# EAGLE design master_fin_itr7 (EAGLE 9.6.2)

## Sheet 1 of 2
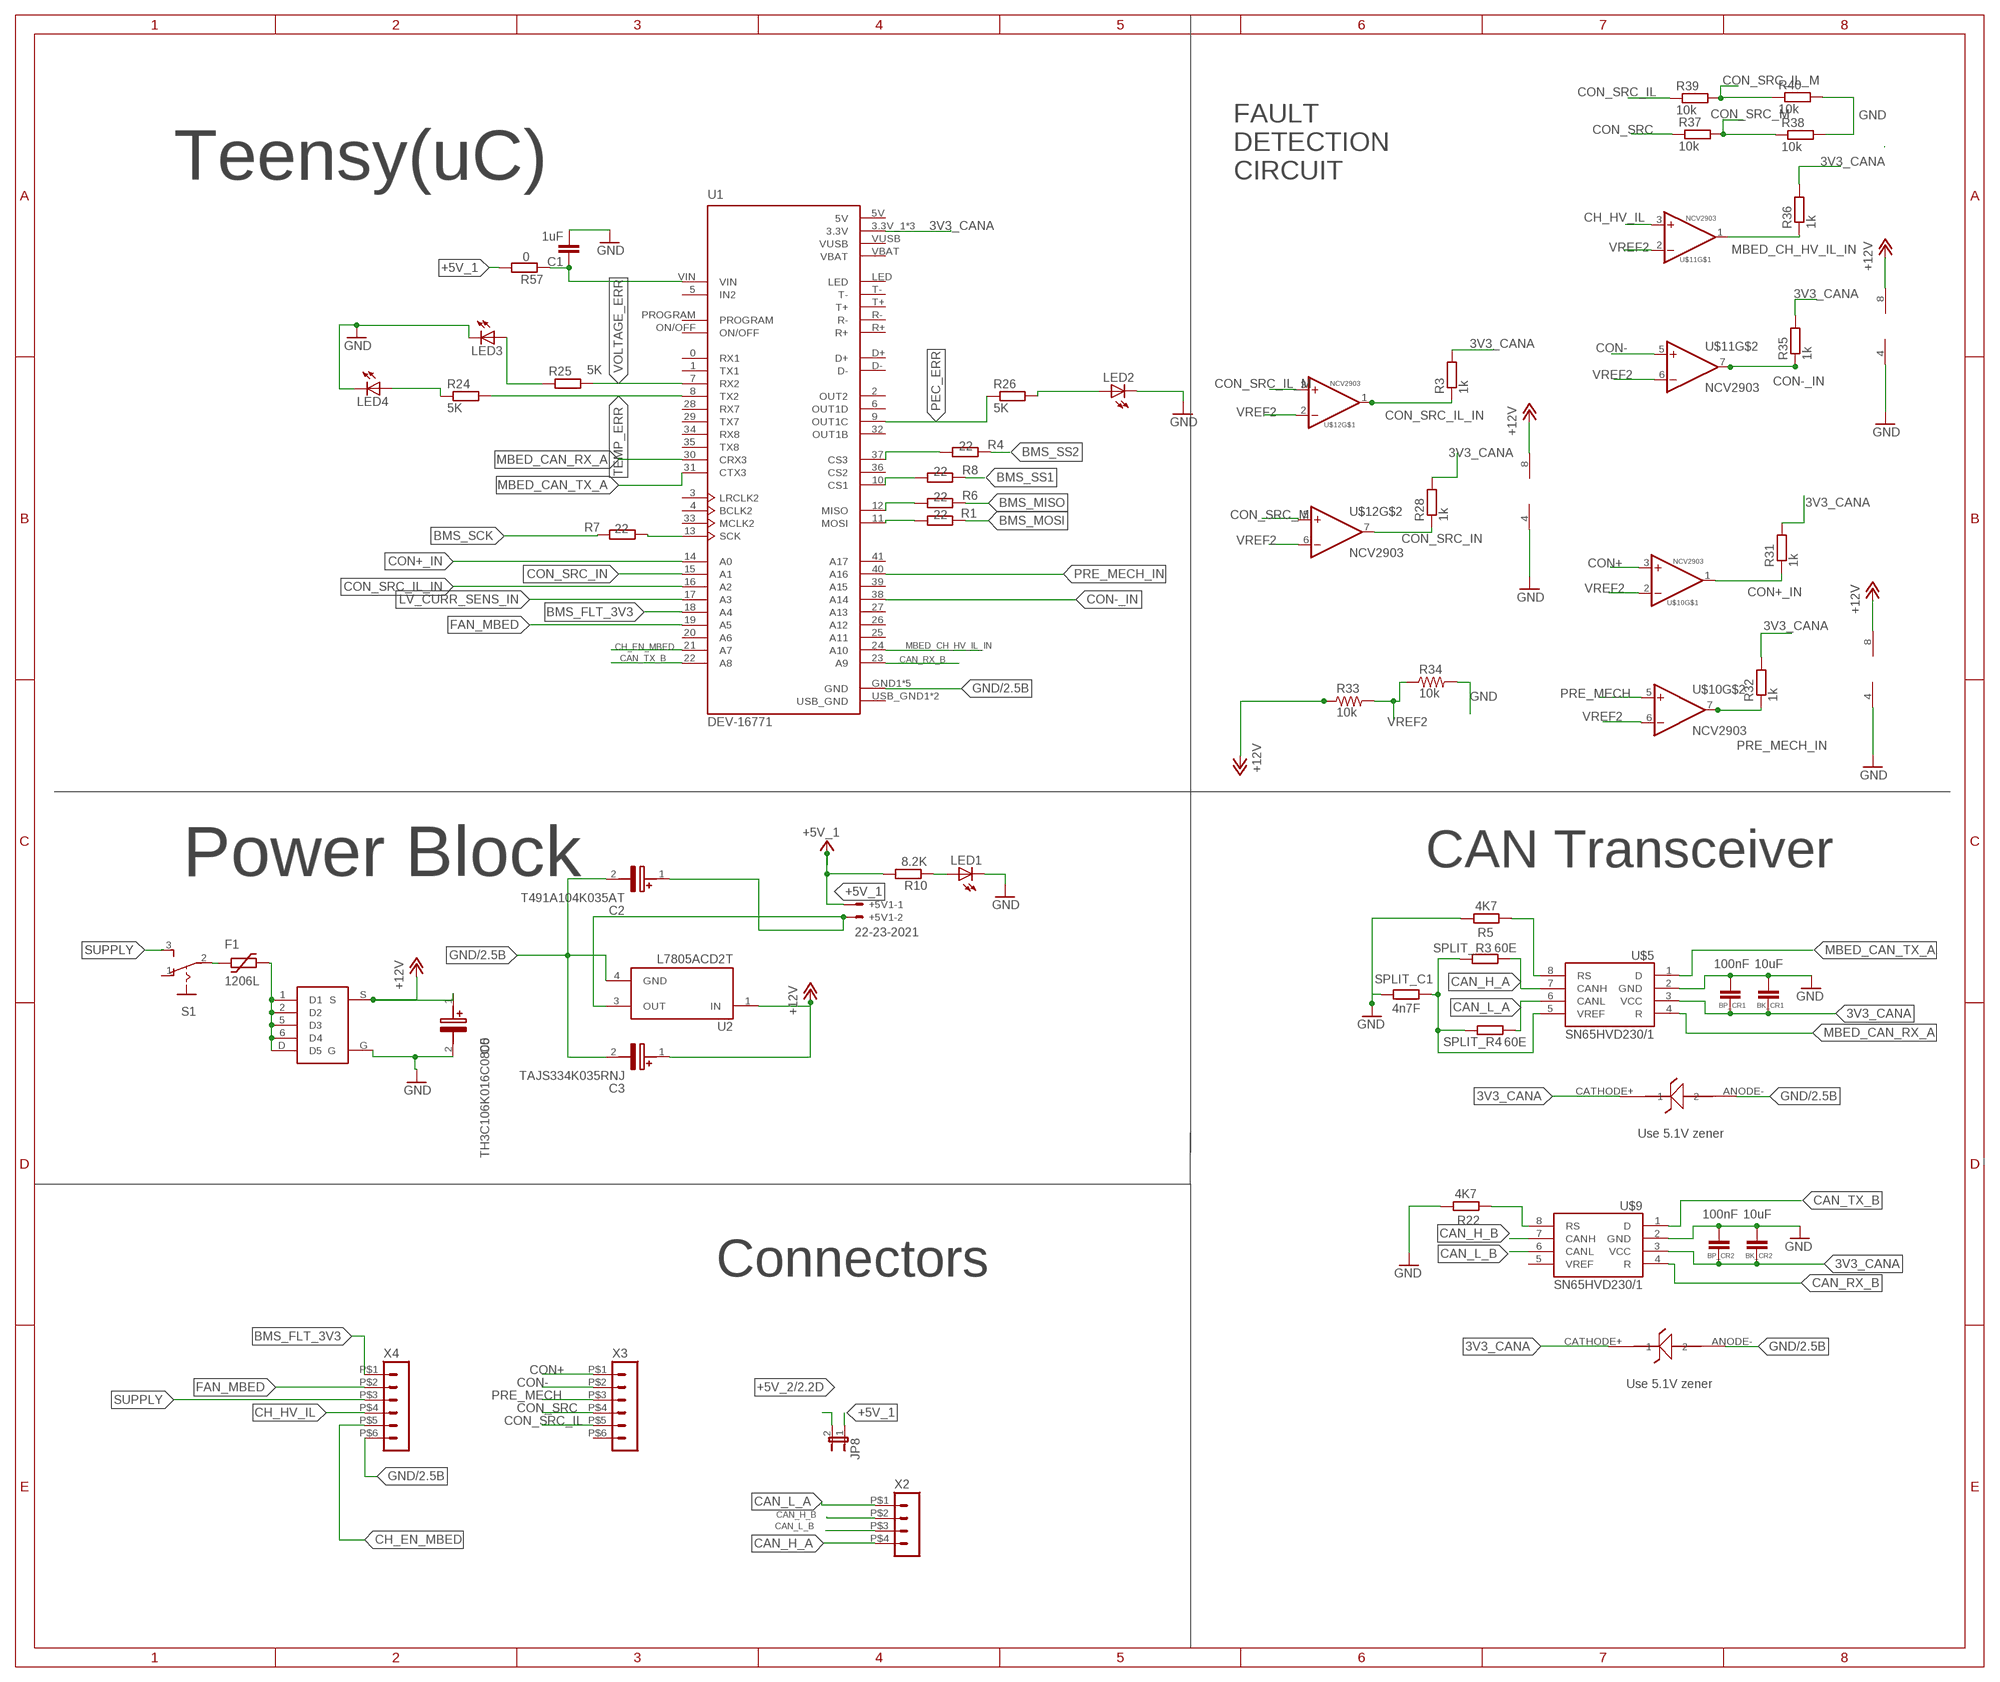
[diagram p0: schematic, sheet 1]

### Parts
+5V1  22-23-2021  [22-23-2021]
BK_CR1  10uF  C-EUC0805  [C0805]
BK_CR2  10uF  C-EUC0805  [C0805]
BP_CR1  100nF  C-EUC0805  [C0805]
BP_CR2  100nF  C-EUC0805  [C0805]
C1  1uF  C-EUC0805K  [C0805K]
C2  T491A104K035AT  [T491A]
C3  TAJS334K035RNJ  [CAPPM3216X120N]
C5  TH3C106K016C0800  [CAPPM6032X280N]
F1  1206L  [1206L]
JP8  JP1E  [JP1]
LED1  LED  LEDCHIP-LED0805  [CHIP-LED0805]
LED2  LED  LEDCHIP-LED0805  [CHIP-LED0805]
LED3  LED  LEDCHIP-LED0805  [CHIP-LED0805]
LED4  LED  LEDCHIP-LED0805  [CHIP-LED0805]
R1  22  R-EU_R0805  [R0805]
R3  1k  R-EU_M0805  [M0805]
R4  22  R-EU_R0805  [R0805]
R5  4K7  R-EU_R0805  [R0805]
R6  22  R-EU_R0805  [R0805]
R7  22  R-EU_R0805  [R0805]
R8  22  R-EU_R0805  [R0805]
R10  8.2K  R-EU_R0805  [R0805]
R22  4K7  R-EU_R0805  [R0805]
R24  5K  R-EU_R0805  [R0805]
R25  5K  R-EU_R0805  [R0805]
R26  5K  R-EU_R0805  [R0805]
R28  1k  R-EU_M0805  [M0805]
R31  1k  R-EU_M0805  [M0805]
R32  1k  R-EU_M0805  [M0805]
R33  10k  RC-MASTER-SMD_R_0603MP  [RC-MASTER-SMD_R0603MP]
R34  10k  RC-MASTER-SMD_R_0603MP  [RC-MASTER-SMD_R0603MP]
R35  1k  R-EU_M0805  [M0805]
R36  1k  R-EU_M0805  [M0805]
R37  10k  R-EU_M0805  [M0805]
R38  10k  R-EU_M0805  [M0805]
R39  10k  R-EU_M0805  [M0805]
R40  10k  R-EU_M0805  [M0805]
R57  0  R-EU_R0805  [R0805]
S1  STS121PC04  [STS121PC04]
S4  DMP3125L/SQ3419AEEV  [DMP3125L/SQ3419AEEV]
SPLIT_C1  4n7F  R-EU_R0805  [R0805]
SPLIT_R3  60E  R-EU_R0805  [R0805]
SPLIT_R4  60E  R-EU_R0805  [R0805]
U1  DEV-16771  [MODULE_DEV-16771]
U2  L7805ACD2T  [VREG_L7805ACD2T]
U$5  SN65HVD230/1  [SO8]
U$6  ZENER_DIODE  [SOD323HE]
U$8  ZENER_DIODE  [SOD323HE]
U$9  SN65HVD230/1  [SO8]
U$10  NCV2903  [SOIC-8]
U$11  NCV2903  [SOIC-8]
U$12  NCV2903  [SOIC-8]
X2  CON-MOLEX-MICRO-FIT-3_0_HEADER_POS4_43045-0412  [CON-MOLEX-MICRO-FIT-3_0_43045-0412]
X3  HEADER_POS6_43045-0612  [43045-0612]
X4  HEADER_POS6_43045-0612  [43045-0612]

### Nets
3V3_CANA: BK_CR1.1 BK_CR2.1 BP_CR1.1 BP_CR2.1 R3.2 R28.2 R31.2 R32.2 R35.2 R36.2 U1.3.3V_1(3.3V) U1.3.3V_2(3.3V) U1.3.3V_3(3.3V) U$5.3(VCC) U$6.CATHODE+ U$8.CATHODE+ U$9.3(VCC)
+5V_1: +5V1.1 JP8.1 R10.2 R57.2
+5V_2: JP8.2 ; also sheet 2
+12V: C3.1(+) C5.1(+) R33.1 S4.S U2.1(IN) U$10.8(V+) U$11.8(V+) U$12.8(V+)
BMS_FLT_3V3: U1.18(A4) X4.P$1
BMS_MISO: R6.1 ; also sheet 2
BMS_MOSI: R1.1 ; also sheet 2
BMS_SCK: R7.1 ; also sheet 2
BMS_SS1: R8.1 ; also sheet 2
BMS_SS2: R4.1 ; also sheet 2
CAN_H_A: SPLIT_R3.1 U$5.7(CANH) X2.P$4
CAN_H_B: U$9.7(CANH) X2.P$2
CAN_L_A: SPLIT_R4.1 U$5.6(CANL) X2.P$1
CAN_L_B: U$9.6(CANL) X2.P$3
CAN_RX_B: U1.23(A9) U$9.4(R)
CAN_TX_B: U1.22(A8) U$9.1(D)
CH_EN_MBED: U1.21(A7) X4.P$5
CH_HV_IL: U$11.3(+IN) X4.P$4
CON+: U$10.3(+IN) X3.P$1
CON+_IN: R31.1 U1.14(A0) U$10.1(OUT)
CON-: U$11.5(+IN) X3.P$2
CON-_IN: R35.1 U1.38(A14) U$11.7(OUT)
CON_SRC: R37.1 X3.P$4
CON_SRC_IL: R39.1 X3.P$5
CON_SRC_IL_IN: R3.1 U1.16(A2) U$12.1(OUT)
CON_SRC_IL_M: R39.2 R40.1 U$12.3(+IN)
CON_SRC_IN: R28.1 U1.15(A1) U$12.7(OUT)
CON_SRC_M: R37.2 R38.1 U$12.5(+IN)
FAN_MBED: U1.19(A5) X4.P$2
GND: BK_CR1.2 BK_CR2.2 BP_CR1.2 BP_CR2.2 C1.2 C2.2(-) C3.2(-) C5.2(-) LED1.C LED2.C LED3.C LED4.C R5.1 R22.1 R34.2 R38.2 R40.2 S4.G SPLIT_C1.2 U1.GND1(GND) U1.GND2(GND) U1.GND3(GND) U1.GND4(GND) U1.GND5(GND) U2.4(GND) U$5.2(GND) U$6.ANODE- U$8.ANODE- U$9.2(GND) U$10.4(V-) U$11.4(V-) U$12.4(V-) X4.P$6 ; also sheet 2
LV_CURR_SENS_IN: U1.17(A3)
MBED_CAN_RX_A: U1.30(CRX3) U$5.4(R)
MBED_CAN_TX_A: U1.31(CTX3) U$5.1(D)
MBED_CH_HV_IL_IN: R36.1 U1.24(A10) U$11.1(OUT)
N$2: R4.2 U1.37(CS3)
N$3: F1.P$1 S1.2(P)
N$4: R5.2 U$5.8(RS)
N$6: R22.2 U$9.8(RS)
N$7: R1.2 U1.11(MOSI)
N$8: R6.2 U1.12(MISO)
N$9: R8.2 U1.10(CS1)
N$10: R7.2 U1.13(SCK)
N$11: +5V1.2 C2.1(+) U2.3(OUT)
N$13: LED1.A R10.1
N$18: LED3.A R25.1
N$21: LED4.A R24.1
N$22: LED2.A R26.2
N$27: SPLIT_C1.1 SPLIT_R3.2 SPLIT_R4.2 U$5.5(VREF)
N$46: F1.P$2 S4.1(D1) S4.2(D2) S4.5(D3) S4.6(D4) S4.D(D5)
N$62: C1.1 R57.1 U1.VIN
PEC_ERR: R26.1 U1.9(OUT1C)
PRE_MECH: U$10.5(+IN) X3.P$3
PRE_MECH_IN: R32.1 U1.40(A16) U$10.7(OUT)
SUPPLY: S1.3(S) X4.P$3
TEMP_ERR: R24.2 U1.8(TX2)
VOLTAGE_ERR: R25.2 U1.7(RX2)
VREF2: R33.2 R34.1 U$10.2(-IN) U$10.6(-IN) U$11.2(-IN) U$11.6(-IN) U$12.2(-IN) U$12.6(-IN)
Unconnected: S1.1(O) U1.0(RX1) U1.1(TX1) U1.2(OUT2) U1.3(LRCLK2) U1.4(BCLK2) U1.5(IN2) U1.6(OUT1D) U1.20(A6) U1.25(A11) U1.26(A12) U1.27(A13) U1.28(RX7) U1.29(TX7) U1.32(OUT1B) U1.33(MCLK2) U1.34(RX8) U1.35(TX8) U1.36(CS2) U1.39(A15) U1.41(A17) U1.D+ U1.D- U1.LED U1.ON/OFF U1.PROGRAM U1.R+ U1.R- U1.T+ U1.T- U1.VBAT U1.VUSB U$9.5(VREF) X3.P$6

### Notes on the sheet
- FAULT 
  DETECTION 
  CIRCUIT
- Teensy(uC)
- Power Block | CAN Transceiver
- Use 5.1V zener
- Connectors
- Use 5.1V zener

## Sheet 2 of 2
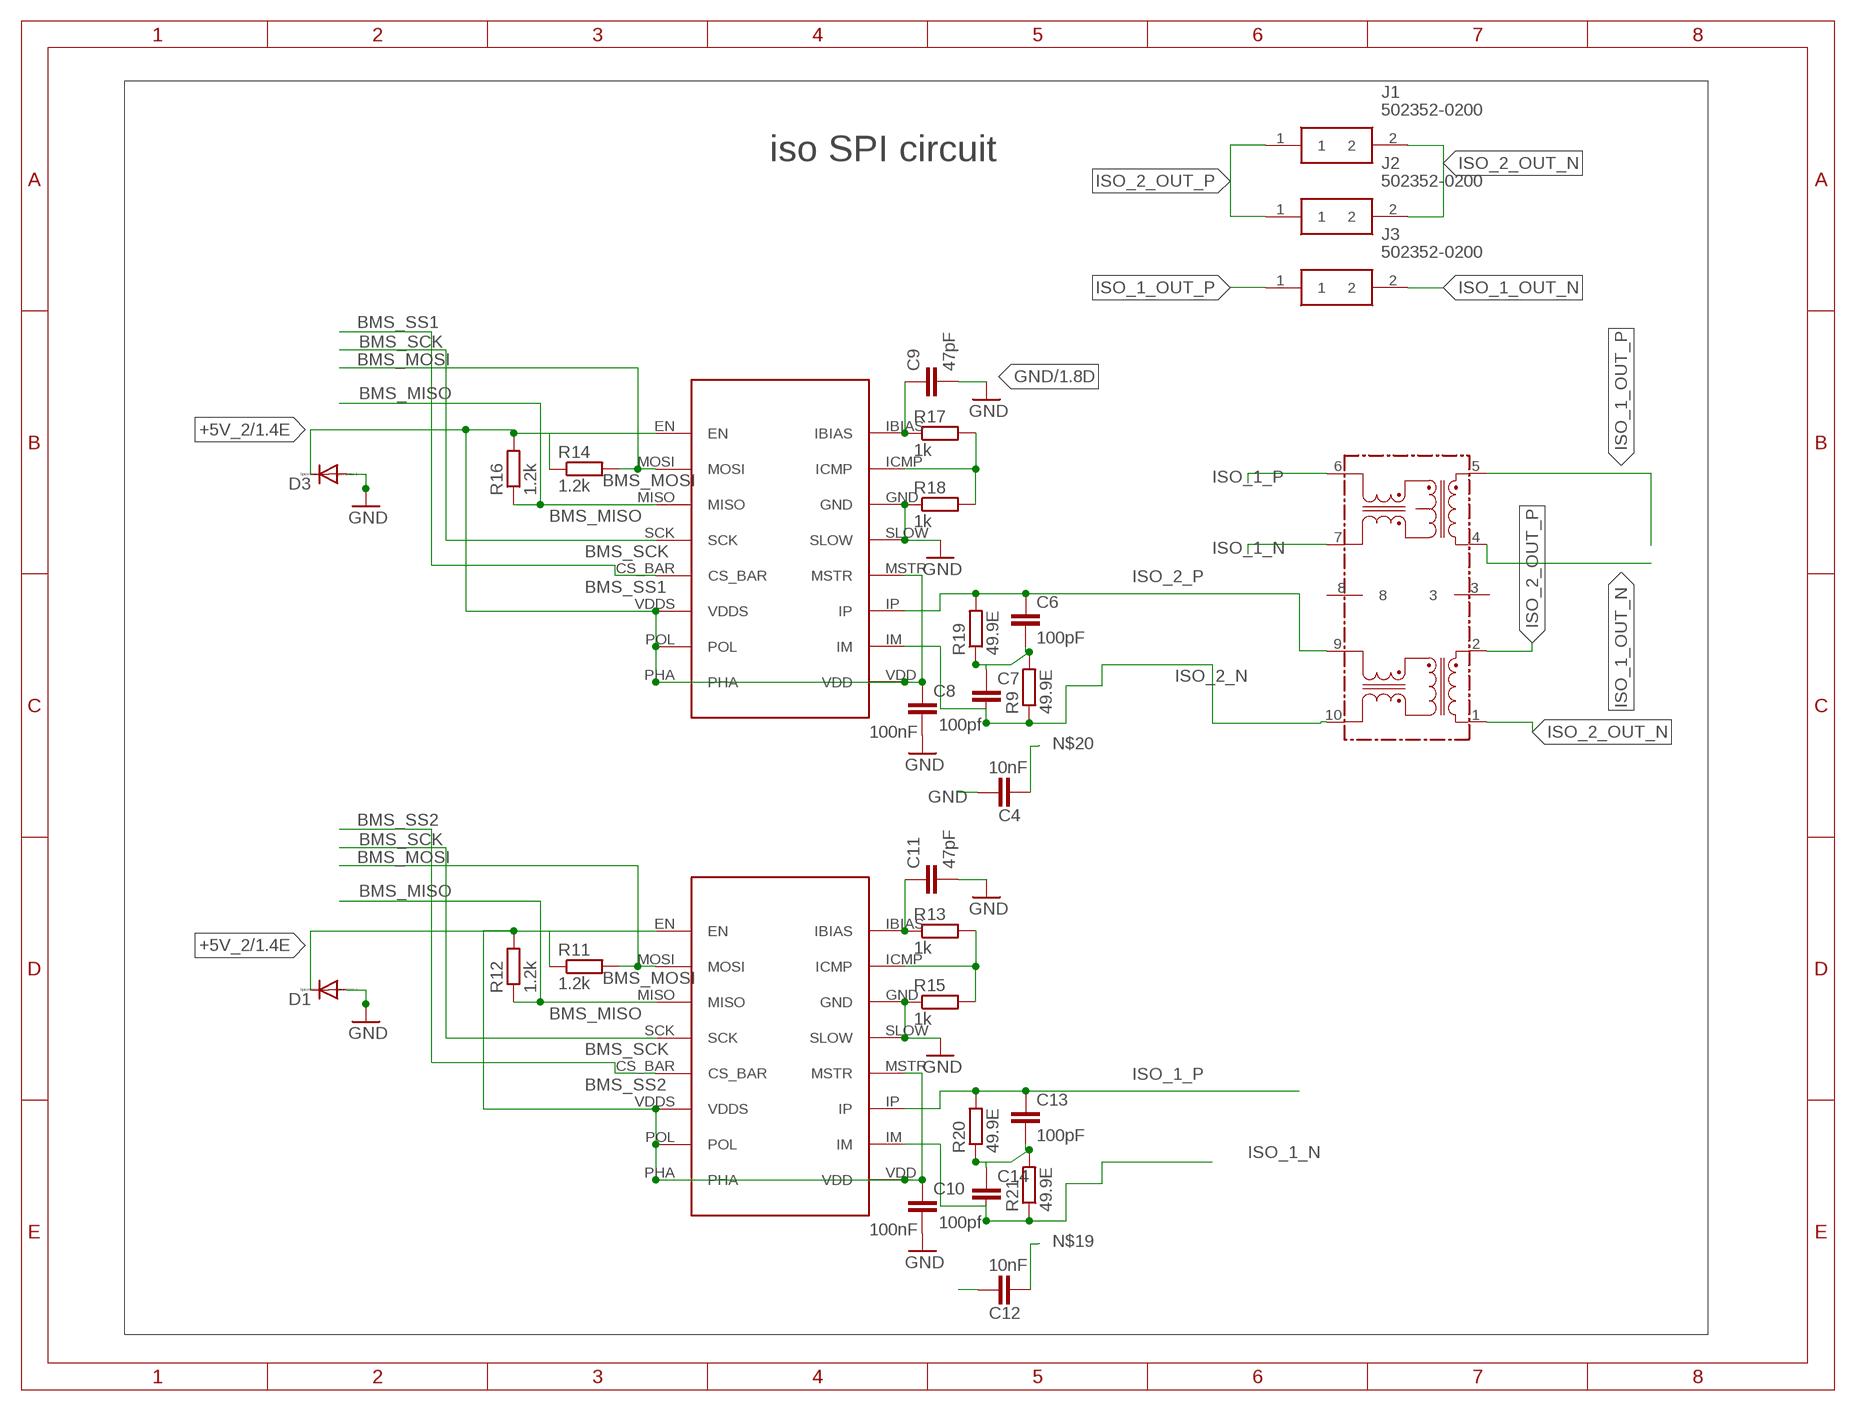
[diagram p1: schematic, sheet 2]

### Parts
C4  10nF  C-EUC0805  [C0805]
C6  100pF  C-EUC0603  [C0603]
C7  100pf  C-EUC0603  [C0603]
C8  100nF  C-EUC0805  [C0805]
C9  47pF  C-EUC0805  [C0805]
C10  100nF  C-EUC0805  [C0805]
C11  47pF  C-EUC0805  [C0805]
C12  10nF  C-EUC0805  [C0805]
C13  100pF  C-EUC0603  [C0603]
C14  100pf  C-EUC0603  [C0603]
D1  DIODE-SOD123  [SOD123]
D3  DIODE-SOD123  [SOD123]
J1  502352-0200  [5023520200]
J2  502352-0200  [5023520200]
J3  502352-0200  [5023520200]
R9  49.9E  R-EU_R0805  [R0805]
R11  1.2k  R-EU_R0805  [R0805]
R12  1.2k  R-EU_R0805  [R0805]
R13  1k  R-EU_R0805  [R0805]
R14  1.2k  R-EU_R0805  [R0805]
R15  1k  R-EU_R0805  [R0805]
R16  1.2k  R-EU_R0805  [R0805]
R17  1k  R-EU_R0805  [R0805]
R18  1k  R-EU_R0805  [R0805]
R19  49.9E  R-EU_R0805  [R0805]
R20  49.9E  R-EU_R0805  [R0805]
R21  49.9E  R-EU_R0805  [R0805]
U$1  LTC6820  [16-PINMSOP]
U$2  HM2100NL  [HM2100NL]
U$4  LTC6820  [16-PINMSOP]

### Nets
+5V_2: C8.1 C10.1 D1.C D3.C R11.1 R12.2 R14.1 R16.2 U$1.EN U$1.MSTR U$1.PHA U$1.POL U$1.VDD U$1.VDDS U$4.EN U$4.MSTR U$4.PHA U$4.POL U$4.VDD U$4.VDDS ; also sheet 1
BMS_MISO: R12.1 R16.1 U$1.MISO U$4.MISO ; also sheet 1
BMS_MOSI: R11.2 R14.2 U$1.MOSI U$4.MOSI ; also sheet 1
BMS_SCK: U$1.SCK U$4.SCK ; also sheet 1
BMS_SS1: U$1.CS_BAR ; also sheet 1
BMS_SS2: U$4.CS_BAR ; also sheet 1
GND: C4.1 C8.2 C9.2 C10.2 C11.2 C12.1 D1.A D3.A R15.1 R18.1 U$1.GND U$1.SLOW U$4.GND U$4.SLOW ; also sheet 1
ISO_1_N: C14.2 R21.1 U$2.7 U$4.IM
ISO_1_OUT_N: J3.2 U$2.4
ISO_1_OUT_P: J3.1 U$2.5
ISO_1_P: C13.1 R20.2 U$2.6 U$4.IP
ISO_2_N: C7.2 R9.1 U$1.IM U$2.10
ISO_2_OUT_N: J1.2 J2.2 U$2.1
ISO_2_OUT_P: J1.1 J2.1 U$2.2
ISO_2_P: C6.1 R19.2 U$1.IP U$2.9
N$12: R17.2 R18.2 U$1.ICMP
N$14: C9.1 R17.1 U$1.IBIAS
N$16: R13.2 R15.2 U$4.ICMP
N$17: C11.1 R13.1 U$4.IBIAS
N$19: C12.2 C13.2 C14.1 R20.1 R21.2
N$20: C4.2 C6.2 C7.1 R9.2 R19.1
Unconnected: U$2.3 U$2.8

### Notes on the sheet
- iso SPI circuit

## Power pins joined to a net without a drawn wire
5V: U1.5V
USB_GND: U1.USB_GND1(USB_GND) U1.USB_GND2(USB_GND)

## Library data of the parts
+5V1 = con-molex:22-23-2021: .100" (2.54mm) Center Header - 2 Pin; MF: MOLEX; MPN: 22-23-2021; OC_FARNELL: 1462926; OC_NEWARK: 25C3832
BK_CR1 BK_CR2 BP_CR1 BP_CR2 C4 C8-C12 = rcl:C-EU: CAPACITOR, European symbol; SPICEPREFIX: C
C1 C6 C7 C13 C14 = IIT_BOMBAY_Racing-1:C-EU: CAPACITOR, European symbol
C2 = SamacSys_Parts:T491A104K035AT: T491, Tantalum, MnO2 Tantalum, Commercial Grade, .1 uF, 10%, 35 VDC, 125?C, -55?C, 85?C, SMD, MnO2, Molded, 4 % , 20 Ohms, 500 nA, 58.6 mg, 3216, 1.6mm, Height Max = 1.8mm, 2000, 156 Weeks Source: Datasheet <https://content.kemet.com/datasheets/KEM_T2005_T491.pdf>; DESCRIPTION: T491, Tantalum, MnO2 Tantalum, Commercial Grade, .1 uF, 10%, 35 VDC, 125?C, -55?C, 85?C, SMD, MnO2, Molded, 4 % , 20 Ohms, 500 nA, 58.6 mg, 3216, 1.6mm, Height Max = 1.8mm, 2000, 156 Weeks; HEIGHT: 1.8mm; MANUFACTURER_NAME: KEMET; MANUFACTURER_PART_NUMBER: T491A104K035AT; MOUSER_PART_NUMBER: 80-T491A104K035; MOUSER_PRICE-STOCK: https://www.mouser.co.uk/ProductDetail/KEMET/T491A104K035AT?qs=VCf6WUQjPgHZen45Mmzj1w%3D%3D
C3 = SamacSys_Parts:TAJS334K035RNJ: AVX - TAJS334K035RNJ - CAP, TANT, 330NF, 35V, CASE S Source: Datasheet <http://datasheets.avx.com/TAJ.pdf>; DESCRIPTION: AVX - TAJS334K035RNJ - CAP, TANT, 330NF, 35V, CASE S; HEIGHT: 1.2mm; MANUFACTURER_NAME: AVX; MANUFACTURER_PART_NUMBER: TAJS334K035RNJ; MOUSER_PART_NUMBER: 581-TAJS334K035RNJ; MOUSER_PRICE-STOCK: https://www.mouser.co.uk/ProductDetail/AVX/TAJS334K035RNJ?qs=vvquVF4vQRkJRvRkvcVUbg%3D%3D
C5 = SamacSys_Parts:TH3C106K016C0800: Solid Tantalum Surface Mount Capacitors TANTAMOUNT(TM) Molded Case, HI-TMP High Temperature 150 C, Automotive Grade Source: Datasheet <http://www.vishay.com/doc?40084>; DESCRIPTION: Solid Tantalum Surface Mount Capacitors TANTAMOUNT(TM) Molded Case, HI-TMP High Temperature 150 C, Automotive Grade; HEIGHT: 2.8mm; MANUFACTURER_NAME: Vishay; MANUFACTURER_PART_NUMBER: TH3C106K016C0800; MOUSER_PART_NUMBER: 74-TH3C106K016C0800; MOUSER_PRICE-STOCK: https://www.mouser.co.uk/ProductDetail/Vishay-Sprague/TH3C106K016C0800?qs=l4Gc20tDgJLNAEbL48SStQ%3D%3D
D1 D3 = IIT_BOMBAY_Racing-1:DIODE-: DIODE
F1 = IIT_BOMBAY_Racing:1206L
J1-J3 = SamacSys_Parts:502352-0200: Molex DURACLIK 502352, 2mm Pitch, 2 Way, 1 Row, Right Angle PCB Header, Surface Mount Source: Datasheet <https://www.molex.com/pdm_docs/sd/5023520200_sd.pdf>; DESCRIPTION: Molex DURACLIK 502352, 2mm Pitch, 2 Way, 1 Row, Right Angle PCB Header, Surface Mount; HEIGHT: mm; MANUFACTURER_NAME: Molex; MANUFACTURER_PART_NUMBER: 502352-0200; MOUSER_PART_NUMBER: 538-502352-0200; MOUSER_PRICE-STOCK: https://www.mouser.co.uk/ProductDetail/Molex/502352-0200?qs=cPOO8qjhL6OPJnOOkJoW%252Bw%3D%3D
JP8 = jumper:JP1E: JUMPER
LED1-LED4 = led:LED: LED OSRAM: - CHIPLED LG R971, LG N971, LY N971, LG Q971, LY Q971, LO R971, LY R971 LH N974, LH R974 LS Q976, LO Q976, LY Q976 LO Q996 - Hyper CHIPLED LW Q18S LB Q993, LB Q99A, LB R99A - SideLED LS A670, LO A670, LY A670, LG A670, LP A670 LB A673, LV A673, LT A673, LW A673 LH A674 LY A675 LS A676, LA A676, LO A676, LY A676, LW A676 LS A679, LY A679, LG A679 - Hyper Micro SIDELED® LS Y876, LA Y876, LO Y876, LY Y876 LT Y87S - SmartLED LW L88C, LW L88S LB L89C, LB L89S, LG L890 LS L89K, LO L89K, LY L89K LS L896, LA L896, LO L896, LY L896 - TOPLED LS T670, LO T670, LY T670, LG T670, LP T670 LSG T670, LSP T670, LSY T670, LOP T670, LYG T670 LG T671, LOG T671, LSG T671 LB T673, LV T673, LT T673, LW T673 LH T674 LS T676, LA T676, LO T676, LY T676, LB T676, LH T676, LSB T676, LW T676 LB T67C, LV T67C, LT T67C, LS T67K, LO T67K, LY T67K, LW E67C LS E67B, LA E67B, LO E67B, LY E67B, LB E67C, LV E67C, LT E67C LW T67C LS T679, LY T679, LG T679 LS T770, LO T770, LY T770, LG T770, LP T770 LB T773, LV T773, LT T773, LW T773 LH T774 LS E675, LA E675, LY E675, LS T675 LS T776, LA T776, LO T776, LY T776, LB T776 LHGB T686 LT T68C, LB T68C - Hyper Mini TOPLED® LB M676 - Mini TOPLED Santana® LG M470 LS M47K, LO M47K, LY M47K Source: http://www.osram.convergy.de LUXEON: - LUMILED® LXK2-PW12-R00, LXK2-PW12-S00, LXK2-PW14-U00, LXK2-PW14-V00 LXK2-PM12-R00, LXK2-PM12-S00, LXK2-PM14-U00 LXK2-PE12-Q00, LXK2-PE12-R00, LXK2-PE12-S00, LXK2-PE14-T00, LXK2-PE14-U00 LXK2-PB12-K00, LXK2-PB12-L00, LXK2-PB12-M00, LXK2-PB14-N00, LXK2-PB14-P00, LXK2-PB14-Q00 LXK2-PR12-L00, LXK2-PR12-M00, LXK2-PR14-Q00, LXK2-PR14-R00 LXK2-PD12-Q00, LXK2-PD12-R00, LXK2-PD12-S00 LXK2-PH12-R00, LXK2-PH12-S00 LXK2-PL12-P00, LXK2-PL12-Q00, LXK2-PL12-R00 Source: www.luxeon.com KINGBRIGHT: KA-3528ASYC Source: www.kingbright.com; MID: SML-D12M1WT86
R1 R3 R4 R6-R8 R28 R31 R32 R35-R40 R57 = IIT_BOMBAY_Racing:R-EU_: RESISTOR, European symbol
R5 R22 SPLIT_C1 SPLIT_R3 SPLIT_R4 = IIT_BOMBAY_Racing-1:R-EU_: RESISTOR, European symbol
R9 R11-R21 R24-R26 = rcl:R-EU_: RESISTOR, European symbol; SPICEPREFIX: R
R10 = resistor:R-EU_: RESISTOR, European symbol; MID: ERJ-P06J822V
R33 R34 = 52101-101-REV-A_v16:RC-MASTER-SMD_R_: RESISTOR
S1 = switches:STS121PC04: SLIDING SWITCH Distributor Buerklin, 11G810
S4 = SQ3419Pmos:DMP3125L/SQ3419AEEV
U1 = teensy4.1:DEV-16771: RT1062 Teensy 4.1 i.MX ARM Cortex-M7 MPU Embedded Evaluation Board Check availability <https://pricing.snapeda.com/parts/DEV-16771/SparkFun%20Electronics/view-part?ref=eda>; AVAILABILITY: In Stock; DESCRIPTION: RT1062 Teensy 4.1 series ARM® Cortex®-M7 MPU Embedded Evaluation Board; MF: SparkFun Electronics; MP: DEV-16771; PACKAGE: None; PRICE: None; PURCHASE-URL: https://pricing.snapeda.com/search/part/DEV-16771/?ref=eda
U2 = L7805ACD2T:L7805ACD2T: Voltage stabiliser; fixed; 5V; 1.5A; D2PAK; SMD Check availability <https://pricing.snapeda.com/parts/L7805ACD2T/STMicroelectronics/view-part?ref=eda>; AVAILABILITY: In Stock; CHECK_PRICES: https://www.snapeda.com/parts/L7805ACD2T/STMicroelectronics/view-part/?ref=eda; DESCRIPTION: Linear Voltage Regulator IC Positive Fixed 1 Output 1.5A D2PAK; MF: STMicroelectronics; MP: L7805ACD2T; PACKAGE: D2PAK STMicroelectronics; PRICE: None; PURCHASE-URL: https://www.snapeda.com/api/url_track_click_mouser/?unipart_id=680973&manufacturer=STMicroelectronics&part_name=L7805ACD2T&search_term=None; SNAPEDA_LINK: https://www.snapeda.com/parts/L7805ACD2T/STMicroelectronics/view-part/?ref=snap
U$1 U$4 = IIT_BOMBAY_Racing:LTC6820
U$2 = HM2100NL:HM2100NL
U$5 U$9 = texas_1:SN65HVD230/1
U$6 U$8 = mylib:ZENER_DIODE
U$10-U$12 = IIT_BOMBAY_Racing2:NCV2903
X2 = LV Safety:CON-MOLEX-MICRO-FIT-3_0_HEADER_POS4_?: Molex - Micro-Fit 3.0 Series connector, 3.00mm (0.118") pitch header, 4 positions.
X3 X4 = IIT_BOMBAY_Racing2:HEADER_POS6_?: Molex - Micro-Fit 3.0 Series connector, 3.00mm (0.118") pitch header, 6 positions.

## Net classes
0 default: width 0.127 mm, drill 0.127 mm, clearance 0.127 mm

## Board
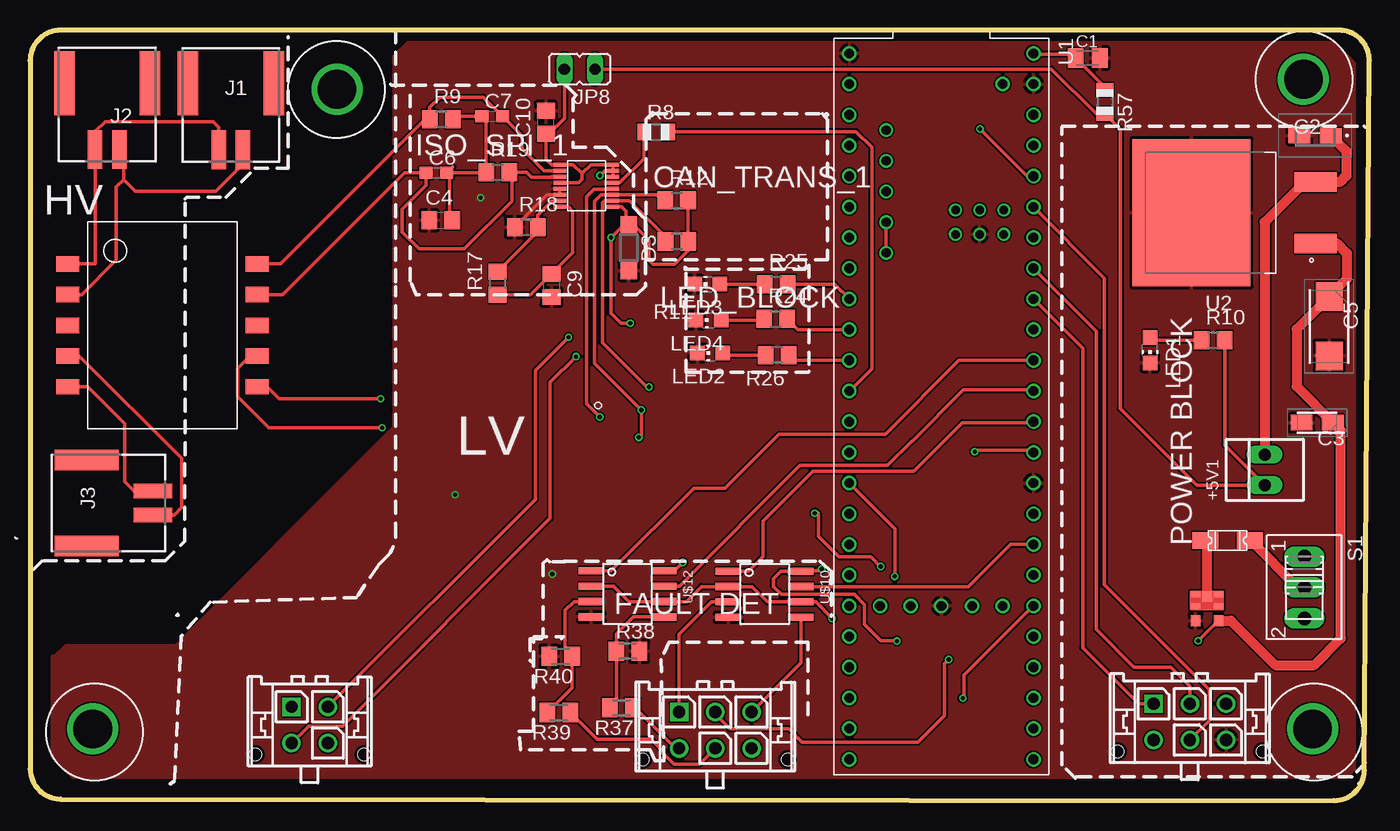
[diagram p2: board, top side]
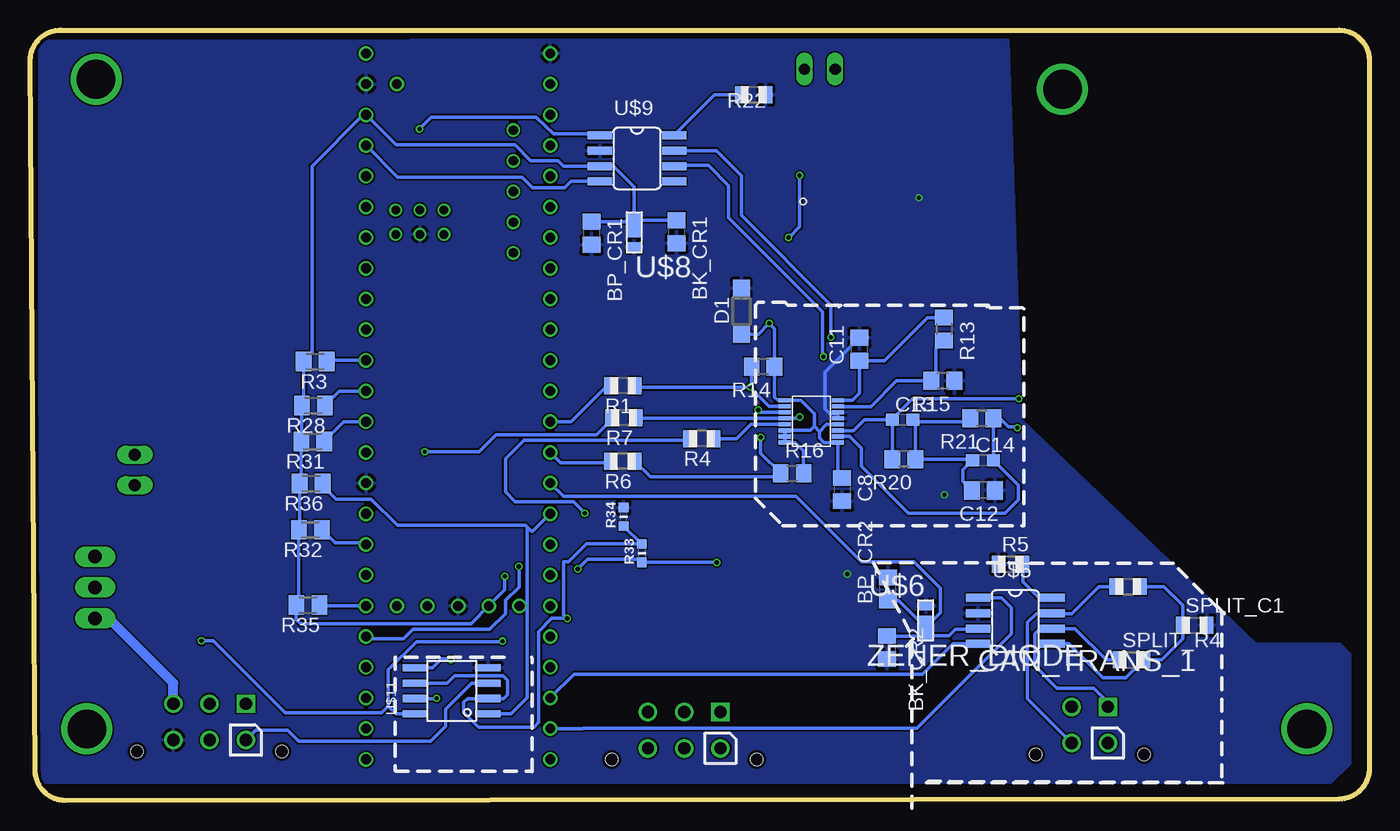
[diagram p3: board, bottom side, seen from below]

Size 110.87 x 63.76 mm. Coordinates in mm from the lower left corner, seen from the top.
Outline: 110.45,2.48 110.87,61.24 arc90 108.37,63.76 2.5,63.76 arc90 0,61.26 0,2.63 arc90 2.5,0.13 107.95,0 arc90 110.45,2.48
Copper layers (1*16): Top 0.035mm / dielectric 1.5mm / Bottom 0.035mm
Design rules "PCB_Power": minimum track width 5mil, minimum drill 10mil, track to track 5mil, track to pad 5mil, pad to pad 5mil, via to via 5mil, smd to smd 5mil, copper to edge 10mil, drill to drill 6mil, minimum pad ring 5mil, minimum via ring 5mil, stop-mask expansion 3mil, vias tented up to drill 0mil, thermal gap 10mil

### Footprints (pad centres in the part's own frame; a part is rotated, then mirrored left to right if it is on the bottom)
22-23-2021 = drill 1 long: 1 -1.27,0; 2 1.27,0
C0805 = smd 1.3 x 1.5: 1 -0.95,0; 2 0.95,0
C0805K = smd 1.3 x 1.6: 1 -1,0; 2 1,0
T491A = smd 1.8 x 1.23: 1 -1.31,0; 2 1.31,0
CAPPM3216X120N = smd 1.8 x 1.3: 1 -1.3,0; 2 1.3,0
CAPPM6032X280N = smd 2.35 x 2.25: 1 -2.45,0; 2 2.45,0
C0603 = smd 1.1 x 1: 1 -0.85,0; 2 0.85,0
SOD123 = smd 1.4 x 1.4: A 1.9,0; C -1.9,0
1206L = smd 2.16 x 1.4: P$1 -1.85,0; P$2 1.85,0
5023520200 = smd 1.2 x 3.2: 1 -1,-1; 2 1,-1 | smd 1.7 x 5.3: 3 -3.55,-6.48; 4 3.55,-6.48
JP1 = drill 0.914 long: 1 0,-1.27; 2 0,1.27
CHIP-LED0805 = smd 1.2 x 1.2: A 0,-1.05; C 0,1.05
R0805 = smd 1.1 x 1.4: 1 -1,0; 2 1,0
M0805 = smd 1.3 x 1.6: 1 -0.95,0; 2 0.95,0
R0805' = smd 1.3 x 1.5: 1 -0.95,0; 2 0.95,0
RC-MASTER-SMD_R0603MP = smd 0.8 x 0.8: 1 -0.762,0; 2 0.762,0
STS121PC04 = drill 1.118 long: 1 -3.81,0; 2 -1.27,0; 3 1.29,0
DMP3125L/SQ3419AEEV = smd 0.51 x 0.8: 1 -2.64,-0.95; 2 -1.64,-0.95; 5 -1.64,0.95; 6 -2.64,0.95 | smd 0.9 x 0.8: D -2.45,0; G -0.45,-0.95; S -0.45,0.95
MODULE_DEV-16771 = drill 0.8: 0 -26.67,-7.62; 1 -24.13,-7.62; 2 -21.59,-7.62; 3 -19.05,-7.62; 3.3V_1 6.35,-7.62; 3.3V_2 -24.13,7.62; 3.3V_3 16.51,-2.54; 4 -16.51,-7.62; 5 -13.97,-7.62; 6 -11.43,-7.62; 7 -8.89,-7.62; 8 -6.35,-7.62; 9 -3.81,-7.62; 10 -1.27,-7.62; 11 1.27,-7.62; 12 3.81,-7.62; 13 3.81,7.62; 14 1.27,7.62; 15 -1.27,7.62; 16 -3.81,7.62; 17 -6.35,7.62; 18 -8.89,7.62; 19 -11.43,7.62; 20 -13.97,7.62; 21 -16.51,7.62; 22 -19.05,7.62; 23 -21.59,7.62; 24 8.89,-7.62; 25 11.43,-7.62; 26 13.97,-7.62; 27 16.51,-7.62; 28 19.05,-7.62; 29 21.59,-7.62; 30 24.13,-7.62; 31 26.67,-7.62; 32 29.21,-7.62; 33 29.21,7.62; 34 26.67,7.62; 35 24.13,7.62; 36 21.59,7.62; 37 19.05,7.62; 38 16.51,7.62; 39 13.97,7.62; 40 11.43,7.62; 41 8.89,7.62; GND1 -29.21,-7.62; GND2 6.35,7.62; GND3 -26.67,7.62; GND4 16.51,0; ON/OFF 16.51,5.08; PROGRAM 16.51,2.54; VBAT 16.51,-5.08; VIN -29.21,7.62; VUSB -26.67,5.08 | drill 0.75: 5V -22.86,-4.57; D+ -17.78,-4.57; D- -20.32,-4.57; USB_GND1 -15.24,-4.57; USB_GND2 -12.7,-4.57 | drill 0.7: GND5 -14.24,3.17; LED -16.24,3.17; R+ -16.24,5.17; R- -14.24,5.17; T+ -14.24,1.17; T- -16.24,1.17
VREG_L7805ACD2T = smd 3.5 x 1.6: 1 -6.7,2.54; 3 -6.7,-2.54 | smd 9.75 x 12.2: 4 3.575,0
16-PINMSOP = smd 0.343 x 1.016: CS_BAR 0.12,-2.27; EN -1.879,-2.27; GND -0.879,2.13; IBIAS -1.879,2.13; ICMP -1.379,2.13; IM 1.121,2.13; IP 0.621,2.13; MISO -0.879,-2.27; MOSI -1.379,-2.27; MSTR 0.12,2.13; PHA 1.621,-2.27; POL 1.121,-2.27; SCK -0.38,-2.27; SLOW -0.38,2.13; VDD 1.621,2.13; VDDS 0.621,-2.27
HM2100NL = smd 1.27 x 1.89: 1 -5.08,-7.84; 2 -2.54,-7.84; 3 0,-7.84; 4 2.54,-7.84; 5 5.08,-7.84; 6 5.08,7.84; 7 2.54,7.84; 8 0,7.84; 9 -2.54,7.84; 10 -5.08,7.84
SO8 = smd 0.66 x 2.032: 1 -1.905,-3.073; 2 -0.635,-3.073; 3 0.635,-3.073; 4 1.905,-3.073; 5 1.905,3.073; 6 0.635,3.073; 7 -0.635,3.073; 8 -1.905,3.073
SOD323HE = smd 1.092 x 0.787: ANODE- 0,0 | smd 1.092 x 2.007: CATHODE+ 0,-1.829
SOIC-8 = smd 0.6 x 2.1: 1 -1.905,-3; 2 -0.635,-3; 3 0.635,-3; 4 1.905,-3; 5 1.905,3; 6 0.635,3; 7 -0.635,3; 8 -1.905,3
CON-MOLEX-MICRO-FIT-3_0_43045-0412 = drill 1.02 square: P$1 1.5,0 | drill 1.02: P$2 -1.5,0; P$3 1.5,3; P$4 -1.5,3 | hole 1.02: 4.5,3.94; -4.5,3.94
43045-0612 = drill 1.02 square: P$1 3,0 | drill 1.02: P$2 0,0; P$3 -3,0; P$4 3,3; P$5 0,3; P$6 -3,3 | hole 1.02: 6,3.94; -6,3.94

### Placement (x,y rotation side)
+5V1  102.21,27.37 90 top
BK_CR1  57.35,47.08 270 bottom
BK_CR2  39.93,12.66 270 bottom
BP_CR1  64.39,46.95 270 bottom
BP_CR2  39.85,17.51 90 bottom
C1  87.55,61.45 0 top
C2  106.38,55.03 180 top
C3  106.55,31.28 180 top
C4  33.99,48.02 0 top
C5  107.54,39.25 270 top
C6  33.63,51.95 0 top
C7  38.25,56.63 0 top
C8  43.66,25.74 270 bottom
C9  43.15,42.63 270 top
C10  42.7,56.15 90 top
C11  42.21,37.35 90 bottom
C12  31.95,25.67 180 bottom
C13  38.63,31.53 0 bottom
C14  31.98,28.18 0 bottom
D1  51.99,40.5 90 bottom
D3  49.56,45.76 270 top
F1  99.14,21.53 180 top
J1  16.61,52.87 180 top
J2  6.38,52.89 180 top
J3  11.18,24.62 270 top
JP8  45.49,60.54 90 top
LED1  92.71,37.27 180 top
LED2  56.29,37.04 90 top
LED3  56.06,42.73 90 top
LED4  56.16,39.76 90 top
R1  61.8,34.33 180 bottom
R3  87.27,36.33 180 bottom
R4  55.27,29.96 180 bottom
R5  29.69,19.57 0 bottom
R6  61.82,28.08 180 bottom
R7  61.72,31.69 180 bottom
R8  51.82,55.33 0 top
R9  49.9E  [R0805']  34.04,56.4 0 top
R10  8.2K  [R0805']  97.94,38.11 0 top
R11  1.2k  [R0805']  53.54,46.26 180 top
R12  1.2k  [R0805']  53.52,49.67 0 top
R13  1k  [R0805']  35.2,39.03 270 bottom
R14  1.2k  [R0805']  50.19,35.9 180 bottom
R15  1k  [R0805']  35.31,34.73 180 bottom
R16  1.2k  [R0805']  47.78,27.09 0 bottom
R17  1k  [R0805']  38.71,42.81 90 top
R18  1k  [R0805']  41.07,47.46 0 top
R19  49.9E  [R0805']  38.71,52.01 0 top
R20  49.9E  [R0805']  38.53,28.26 180 bottom
R21  49.9E  [R0805']  32.08,31.63 180 bottom
R22  50.98,58.41 180 bottom
R24  5K  [R0805']  61.72,39.86 0 top
R25  5K  [R0805']  61.77,42.73 0 top
R26  5K  [R0805']  61.85,36.87 180 top
R28  87.43,32.7 180 bottom
R31  87.48,29.73 180 bottom
R32  87.68,22.41 180 bottom
R33  60.22,20.48 90 bottom
R34  61.75,23.48 90 bottom
R35  87.88,16.19 180 bottom
R36  87.6,26.25 180 bottom
R37  48.95,7.68 180 top
R38  49.48,12.36 0 top
R39  43.76,7.3 180 top
R40  43.92,11.95 180 top
R57  88.98,57.82 270 top
S1  105.49,16.37 270 top
S4  97.43,14.44 270 top
SPLIT_C1  14.45,14.51 0 bottom
SPLIT_R3  19.96,17.72 0 bottom
SPLIT_R4  19.69,11.64 0 bottom
U1  75.44,32.62 270 top
U2  99.72,48.65 180 top
U$1  45.97,51.01 90 top
U$2  10.95,39.33 270 top
U$4  46.13,31.25 270 bottom
U$5  29.31,14.87 270 bottom
U$6  36.73,16.14 0 bottom
U$8  60.86,45.81 180 bottom
U$9  60.63,53.15 270 bottom
U$10  60.81,17.08 270 top
U$11  75.97,9.08 90 bottom
U$12  49.45,17.11 270 top
X2  23.14,7.76 180 top
X3  56.72,7.33 180 top
X4  96.01,8.01 180 top

### Tracks (layer width: path | path; a pad name or v marks a point on that pad's centre or on a via)
3V3_CANA  (via drill 0.35)
  Top 0.305: U1.3.3V_1 71.58,22.52 v71.58,18.55
  Bottom 0.305: U1.3.3V_1 66.73,25.18 47.47,25.18 42.06,19.77 37.72,19.77 35.51,17.56 35.51,15.53 U$6.CATHODE+ | v71.58,18.55 71.58,17.44 U1.3.3V_3 74.37,14.64 88.49,14.64 88.83,14.98 88.83,15.35 | 88.83,15.35 R35.2 | U$5.3 32.46,14.16 34.26,14.16 34.8,13.63 36.63,13.63 36.73,13.73 U$6.CATHODE+ | BP_CR2.1 38.96,16.55 U$6.CATHODE+ | 88.83,15.35 88.63,15.56 R32.2 88.55,22.49 R36.2 88.43,26.38 R31.2 88.38,29.78 R28.2 88.22,32.85 R3.2 87.53,37.03 87.53,52.51 83.29,56.75 U1.3.3V_2 80.57,54.27 70.74,54.27 69.44,52.97 67.16,52.97 66.7,52.51 U$9.3 62.56,52.51 60.86,50.81 U$8.CATHODE+ | BK_CR2.1 37.43,13.61 U$6.CATHODE+ | BK_CR1.1 60.47,48.03 U$8.CATHODE+ | U$8.CATHODE+ 61.12,47.9 BP_CR1.1
+5V_1
  Top 0.305: R10.2 98.89,29.41 +5V1.1 96.6,26.1 90.25,32.45 90.25,55.55 R57.2 88.26,56.82 84.55,60.54 JP8.1
+5V_2  (via drill 0.35)
  Top 0.305: U$1.PHA 48.24,52.44 | 48.24,52.44 U$1.POL | U$1.POL U$1.VDDS | C10.1 42.7,54.95 | 42.7,54.95 42.7,53.1 43.16,52.64 U$1.VDD 44.96,52.64 45.69,51.9 | 49.33,47.66 D3.C 49.94,47.66 51.23,46.37 51.23,44.72 51.56,44.39 53.34,44.39 54.49,45.54 R11.1 54.47,46.29 R12.2 | 48.24,52.44 48.05,52.64 46.43,52.64 45.69,51.9 | U$1.POL 47.58,52.14 v47.17,51.73 | U$1.EN 48.96,49.14 49.33,48.77 49.33,47.66 | JP8.2 44.22,56.48 42.7,54.95 | v49.68,39.51 48.92,39.51 48.09,40.34 v48.09,46.59 49.15,47.66 49.33,47.66 | 45.69,51.9 45.69,51.42 45.41,51.14 U$1.MSTR
  Bottom 0.305: 48.38,33.11 U$4.EN | 48.38,33.11 47.06,33.11 45.94,31.99 45.94,30.96 | C8.1 44,27.03 U$4.VDD 45.14,29.63 45.52,30.01 45.52,30.54 | R16.2 46.83,28.96 47.5,29.63 U$4.PHA U$4.POL U$4.VDDS 46.26,30.63 45.94,30.96 | 48.38,33.11 48.98,33.11 49.24,33.38 R14.1 49.24,39.07 v49.68,39.51 50.59,38.6 D1.C | v47.17,51.73 47.17,47.48 48.06,46.59 v48.09,46.59 | 45.52,30.54 44.93,31.13 U$4.MSTR | 45.52,30.54 45.94,30.96
+12V  (via drill 0.35)
  Top 0.305: S4.S 96.72,13.22 v96.7,13.22 | v54.03,19.7 53.34,19.01 U$12.8 | v71.75,13.19 71.7,13.24 70.43,13.24 69.09,14.59 69.09,16.22 68.23,17.07 66,17.07 65.98,17.05 62.2,17.05 61.54,17.72 61.54,18.38 62.15,18.99 U$10.8 63.83,19.01 65.38,19.01 v65.53,19.16
  Top 0.813: S4.S 99.42,14.89 103.1,11.21 106.3,11.21 108.51,13.42 108.51,30.62 C3.1 104.85,34.28 104.85,39.01 C5.1 109.02,43.18 109.02,45.3 108.2,46.11 U2.1
  Bottom 0.305: v96.7,13.22 95.73,13.22 89.76,7.25 81.79,7.25 81.23,7.81 | v71.75,13.19 71.81,13.14 78.89,13.14 81.23,10.81 81.23,7.81 | v65.53,19.16 64.72,19.98 60.48,19.98 R33.1 54.05,19.72 v54.03,19.7 | U$11.8 80.59,7.17 81.23,7.81
BMS_FLT_3V3
  Top 0.305: U1.18 87.15,37.43 87.15,12.64 91.77,8.01 X4.P$1
BMS_MISO  (via drill 0.35)
  Top 0.305: v50.39,30.06 50.6,30.26 v50.6,32.32 46.73,36.18 46.73,49.61 47.25,50.14 U$1.MISO 51.86,50.14 52.32,49.67 R12.1
  Bottom 0.305: R6.1 59.53,26.78 49.03,26.78 R16.1 50.39,28.75 v50.39,30.06 | v50.6,32.32 50.41,32.13 U$4.MISO
BMS_MOSI  (via drill 0.35)
  Top 0.305: R11.2 52.59,46.68 49.64,49.64 U$1.MOSI 47.57,49.64 47.41,49.47 47.41,37.9 51.08,34.23 v51.24,34.23
  Bottom 0.305: U$4.MOSI 48.45,32.63 49.72,32.63 51.24,34.16 51.24,34.21 | R1.1 60.68,34.21 51.24,34.21 | R14.2 51.14,34.33 v51.24,34.23 51.24,34.21
BMS_SCK  (via drill 0.35)
  Top 0.305: U$1.SCK 48.22,50.61 46.7,50.61 46.07,49.98 46.07,32.84 v47.16,31.74
  Bottom 0.305: R7.1 60.67,31.63 U$4.SCK 47.27,31.63 v47.16,31.74
BMS_SS1
  Top 0.305: U$1.CS_BAR 48.26,51.15 48.85,51.15 50.82,53.12 R8.1
BMS_SS2
  Bottom 0.305: U$4.CS_BAR 51.2,31.13 52.37,29.96 R4.1
CAN_H_A
  Bottom 0.305: SPLIT_R3.1 22.4,17.72 24.64,15.48 26.21,15.48 | 26.21,15.48 26.19,15.45 27.58,15.45 28.3,14.74 28.3,8.41 X2.P$4 | 26.21,15.48 U$5.7
CAN_H_B  (via drill 0.35)
  Top 0.305: X2.P$2 41.83,24.95 41.83,35.6 v44.58,38.34
  Bottom 0.305: v44.58,38.34 44.58,41.01 51.99,48.42 51.99,51.73 54.05,53.78 U$9.7
CAN_L_A
  Bottom 0.305: SPLIT_R4.1 21.77,11.64 24.36,14.24 U$5.6 27.25,14.24 27.69,13.8 27.69,11.14 25.86,9.31 22.81,9.31 21.64,8.14 X2.P$1
CAN_L_B  (via drill 0.35)
  Top 0.305: v45.19,36.74 43.05,34.61 43.05,23.35 25.86,6.16 23.04,6.16 X2.P$3
  Bottom 0.305: U$9.6 57.51,52.56 54.71,52.56 53.04,50.89 53.04,48.22 45.29,40.47 45.29,36.84 v45.19,36.74
CAN_RX_B
  Bottom 0.305: U$9.4 66.09,51.24 66.62,50.71 69.27,50.71 70.15,51.6 80.44,51.6 U1.23
CAN_TX_B  (via drill 0.35)
  Top 0.305: v78.64,55.59 82.55,51.67 U1.22
  Bottom 0.305: U$9.1 63.82,55.17 67.56,55.17 68.18,55.8 68.22,55.8 68.97,56.55 77.67,56.55 v78.64,55.59
CH_EN_MBED
  Top 0.305: U1.21 88.95,43.24 88.95,17.84 97.61,9.18 97.61,6.61 X4.P$5
CH_HV_IL
  Bottom 0.305: U$11.3 74.32,9.71 76.48,7.56 76.48,6.13 77.7,4.91 88.65,4.91 89.56,5.83 92.2,5.83 X4.P$4
CON+
  Top 0.305: X3.P$1 53.72,13.75 56.41,16.45 U$10.3
CON+_IN
  Top 0.305: U1.14 83.13,31.28 77.17,31.28 73.15,27.27 64.82,27.27 60.68,23.13 60.68,20.18 59.49,18.99 U$10.1
  Bottom 0.305: R31.1 84.9,31.35 U1.14
CON-  (via drill 0.35)
  Top 0.305: v76.05,11.67 75.69,11.31 75.69,7.02 73.51,4.84 63.91,4.84 62.81,5.93 57.94,5.93 56.72,7.15 X3.P$2
  Bottom 0.305: v76.05,11.67 76.05,11.75 76.81,11.75 77.55,11.01 78.95,11.01 U$11.5
CON-_IN  (via drill 0.35)
  Top 0.305: v77.22,8.47 77.31,8.57 77.31,10.37 U1.38
  Bottom 0.305: U1.38 83.08,16.14 86.88,16.14 R35.1 | U$11.7 77.22,8.44 v77.22,8.47
CON_SRC
  Top 0.305: X3.P$4 53.44,4.33 50.09,7.68 R37.1
CON_SRC_IL
  Top 0.305: X3.P$5 55.4,3.01 53.31,3.01 52.4,3.92 52.4,4.08 51.41,5.06 46.95,5.06 R39.1
CON_SRC_IL_IN
  Top 0.305: U1.16 76.91,36.43 70.79,30.31 62,30.31 57.53,25.84 54.94,25.84 48.11,19.01 U$12.1
  Bottom 0.305: U1.16 86.22,36.43 R3.1
CON_SRC_IL_M
  Top 0.305: U$12.3 46.47,16.46 45.02,16.46 44.3,15.73 44.3,12.52 R40.1 44.87,9.35 R39.2
CON_SRC_IN
  Top 0.305: U$12.7 53.75,17.74 63.74,27.74 70.98,27.74 73,29.75 73.02,29.75 77.27,34 82.96,34 U1.15
  Bottom 0.305: U1.15 85.28,33.89 R28.1
CON_SRC_M
  Top 0.305: R37.2 48.53,8.22 R38.1 48.53,13.8 48.56,13.8 49.96,15.2 U$12.5
FAN_MBED
  Top 0.305: U1.19 88.26,38.85 88.26,14.16 91.39,11.03 94.44,11.03 96.01,9.46 X4.P$2
GND  (via drill 0.35)
  Top 0.305: U$1.SLOW U$1.GND 42.8,50.14 R18.1
  Bottom 0.305: U$4.SLOW U$4.GND 44.1,32.03 44.67,32.03 45.06,32.42 45.06,35.45 C11.2
  other vias: 37.29,49.9 35.18,25.31 43.23,18.76
  pour Bottom: 29.93,62.91 79.39,62.91 79.47,62.83 110.08,62.83 110.08,1.92 109.68,1.51 3.18,1.51 1.63,3.06 1.63,12.13 2.44,12.94 9.38,12.94 28.86,31.5
  pour Top: 
  pour Top: 2.94,12.83 2.04,11.93 1.84,11.93 1.84,3.63 2.04,3.43 3.54,1.93 4.44,1.93 108.94,1.93 109.24,2.23 109.64,2.63 109.64,8.93 109.64,61.03 109.44,61.23 107.94,62.73 106.84,62.73 31.24,62.73 30.14,61.63 30.14,30.93 28.44,29.23 12.04,12.83 3.04,12.83
GND1  (via drill 3.2)
  other vias: 5.18,5.93
GND2  (via drill 3.2)
  other vias: 25.4,58.86
GND3  (via drill 3.2)
  other vias: 106.17,5.93
GND4  (via drill 3.2)
  other vias: 105.42,59.69
ISO_1_N  (via drill 0.35)
  Top 0.305: v29.13,30.85 19.74,30.85 17.17,33.41 17.17,35.77 18.19,36.79 U$2.7
  Bottom 0.305: v29.13,30.85 29.24,30.95 29.9,30.95 30.58,31.63 R21.1 C14.2 29.06,26.11 29.06,24.9 30.18,23.79 38.15,23.79 42.04,27.67 42.04,29.15 43.02,30.13 U$4.IM
ISO_1_OUT_N
  Top 0.305: U$2.4 4.07,36.79 12.55,28.32 12.55,24.27 11.9,23.62 J3.2
ISO_1_OUT_P
  Top 0.305: U$2.5 4.75,34.25 7.82,31.18 7.82,26.38 8.58,25.62 J3.1
ISO_1_P  (via drill 0.35)
  Top 0.305: v29.01,33.26 20.6,33.26 19.61,34.25 U$2.6
  Bottom 0.305: C13.1 39.55,31.53 37.82,33.26 v29.01,33.26 | U$4.IP 43.97,30.63 43.96,30.62 42.72,30.62 41.81,31.53 C13.1 | C13.1 R20.2
ISO_2_N
  Top 0.305: U$2.10 20.73,44.41 32.72,56.4 R9.1 33.09,57.38 33.93,58.23 37.5,58.23 C7.2 40.72,55.01 40.72,53.96 42.54,52.14 U$1.IM
ISO_2_OUT_N
  Top 0.305: 3.94,44.41 U$2.1 5.38,44.41 J2.2 | J2.2 5.6,54.12 | J2.2 5.38,55.37 6.2,56.2 15.14,56.2 15.61,55.72 J1.2
ISO_2_OUT_P
  Top 0.305: J2.1 7.72,53.55 7.72,51.4 | 7.72,51.4 7.14,50.81 7.14,44.74 4.27,41.87 U$2.2 | 7.72,51.4 8.69,50.43 15.34,50.43 17.61,52.7 J1.1
ISO_2_P
  Top 0.305: R19.2 39.88,52.01 | 39.88,52.01 41.1,52.01 41.5,51.6 43.17,51.6 43.18,51.61 43.82,51.61 U$1.IP | 39.88,52.01 39.88,49.62 35.92,45.66 32.18,45.66 30.78,47.05 30.78,48.92 32.78,50.91 C6.1 30.99,51.95 20.9,41.87 U$2.9
MBED_CAN_RX_A
  Bottom 0.305: U$5.4 34.49,12.97 37.01,10.45 65.86,10.45 U1.30
MBED_CAN_TX_A
  Bottom 0.305: U1.31 65.14,5.95 65.11,5.98 37.46,5.98 29.64,13.8 29.64,15.96 30.45,16.78 U$5.1
MBED_CH_HV_IL_IN
  Bottom 0.305: R36.1 86.65,26.09 85.52,24.95 82.63,24.95 80.47,22.8 69.88,22.8 69.72,22.64 | 69.72,22.64 69.72,8.49 71.04,7.17 U$11.1 | 69.72,22.64 69.35,22.27 69.28,22.27 U1.24
N$2  (via drill 0.35)
  Top 0.305: v64.95,23.79 65.25,23.79 65.25,21.88 66.95,20.18 69.6,20.18 v70.41,19.37
  Bottom 0.305: U1.37 82.88,13.4 79.93,13.4 79.17,14.16 72.82,14.16 71.5,15.48 71.5,16.57 70.41,17.66 v70.41,19.37 | v64.95,23.79 65.89,24.73 70.71,24.73 71.53,25.54 71.53,28.28 69.98,29.83 56.4,29.83 R4.2
N$3
  Top 0.813: F1.P$1 101.04,21.53 104.92,17.64 S1.2
N$4
  Bottom 0.305: R5.2 28.69,18.11 27.36,16.78 U$5.8
N$6
  Bottom 0.305: U$9.8 54.2,58.41 R22.2
N$7
  Bottom 0.305: R1.2 63.12,34.33 66.09,31.35 U1.11 | U1.11
N$8
  Bottom 0.305: U1.12 66.98,27.98 62.93,27.98 R6.2
N$9
  Top 0.305: U1.10 69.67,35.75 69.67,54.06 68.38,55.36 52.84,55.36 R8.2
N$10  (via drill 0.35)
  Top 0.305: v78.21,28.87 78.33,28.99 82.88,28.99 U1.13
  Bottom 0.305: v78.21,28.87 73.71,28.87 72.29,30.29 63.97,30.29 62.72,31.53 R7.2
N$11
  Top 0.305: U2.3 105.99,51.19
  Top 0.813: +5V1.2 102.21,47.87 105.53,51.19 U2.3 108.46,51.19 108.97,51.7 108.97,53.75 C2.1
N$12
  Top 0.305: U$1.ICMP 43.82,49.61 43.18,49.61 42.02,48.45 R18.2 42.02,47.07 R17.2
N$13
  Top 0.305: R10.1 92.92,38.11 LED1.A
N$14
  Top 0.305: R17.1 41.43,41.86 C9.1 44.91,45.34 44.91,48.78 44.55,49.14 U$1.IBIAS
N$16
  Bottom 0.305: R13.2 35.87,37.41 35.87,35.11 R15.2 39.14,34.73 41.27,32.61 43.97,32.61 U$4.ICMP
N$17
  Bottom 0.305: R13.1 36.57,39.98 40.14,36.4 C11.1 42.21,33.72 42.8,33.13 U$4.IBIAS
N$18
  Top 0.305: LED3.A R25.1
N$19
  Bottom 0.305: R21.2 33.3,31.36 37.95,31.36 C13.2 37.58,31.33 R20.1 32.9,28.26 C14.1 33.63,27.38 33.63,26.39 C12.2
N$20
  Top 0.305: C4.2 34.71,48.25 34.71,51.95 | 34.99,52.46 C6.2 34.71,51.95 | 34.71,51.95 37.71,51.95 R19.1 37.76,56.27 C7.1 35.21,56.63 R9.2
N$21
  Top 0.305: LED4.A 60.71,39.76 60.77,39.83 R24.1
N$22
  Top 0.305: R26.2 57.51,36.87 LED2.A
N$27
  Bottom 0.305: U$5.5 24.89,12.97 22.07,10.15 20.17,10.15 20.17,10.16 SPLIT_R4.2 17.18,11.64 15.45,13.37 SPLIT_C1.1 15.45,16.15 17.02,17.72 SPLIT_R3.2
N$46
  Top 0.305: S4.2 S4.1 96.67,16.89 S4.D 97.62,17.08 S4.6 S4.5
  Top 0.813: F1.P$2 97.43,21.38 S4.D
N$62
  Top 0.305: U1.VIN 83.13,61.76 86.25,61.76 C1.1 88.98,59.03 R57.1
PEC_ERR
  Top 0.305: R26.1 62.8,36.43 U1.9
PRE_MECH
  Top 0.305: U$10.5 63.81,11.42 X3.P$3
PRE_MECH_IN
  Top 0.305: U1.40 81.18,21.19 77.68,17.7 66,17.7 65.98,17.72 U$10.7
  Bottom 0.305: U1.40 83.18,21.32 85.64,21.32 R32.1
SUPPLY
  Bottom 0.813: X4.P$3 99.01,9.74 104.35,15.08 S1.3
TEMP_ERR
  Top 0.305: U1.8 63.56,38.97 R24.2
USB_GND
  Top 0.305: U1.USB_GND1 U1.USB_GND2
VOLTAGE_ERR
  Top 0.305: R25.2 66.6,42.73 U1.7
VREF2  (via drill 0.35)
  Top 0.305: U$12.2 48.31,17.74 49.58,16.47 U$12.6 54.33,16.47 55.58,17.72 U$10.2 59.77,17.72 61.04,16.45 U$10.6 65.05,16.45 66.4,15.1 v66.4,15.07
  Bottom 0.305: U$11.6 76.35,9.71 75.75,10.32 71.72,10.32 71.35,9.94 71.35,8.77 71.68,8.44 U$11.2 74.68,8.44 74.98,8.14 74.98,7.33 73.74,6.08 69.16,6.08 68.78,6.46 68.78,13.98 67.69,15.07 v66.4,15.07 66.7,15.38 66.7,19.75 66.29,19.75 64.8,21.25 R33.2 60.27,21.25 R34.1

### Text on the board
tNames: ISO_SPI_1 | CAN_TRANS_1 | HV | LED_BLOCK | LV | POWER BLOCK | FAULT DET
bNames: CAN_TRANS_1